# Altium schematic sheet medusa-ai-audio.SchDoc
size Legal; SheetNumber: 2; SheetTotal: 5
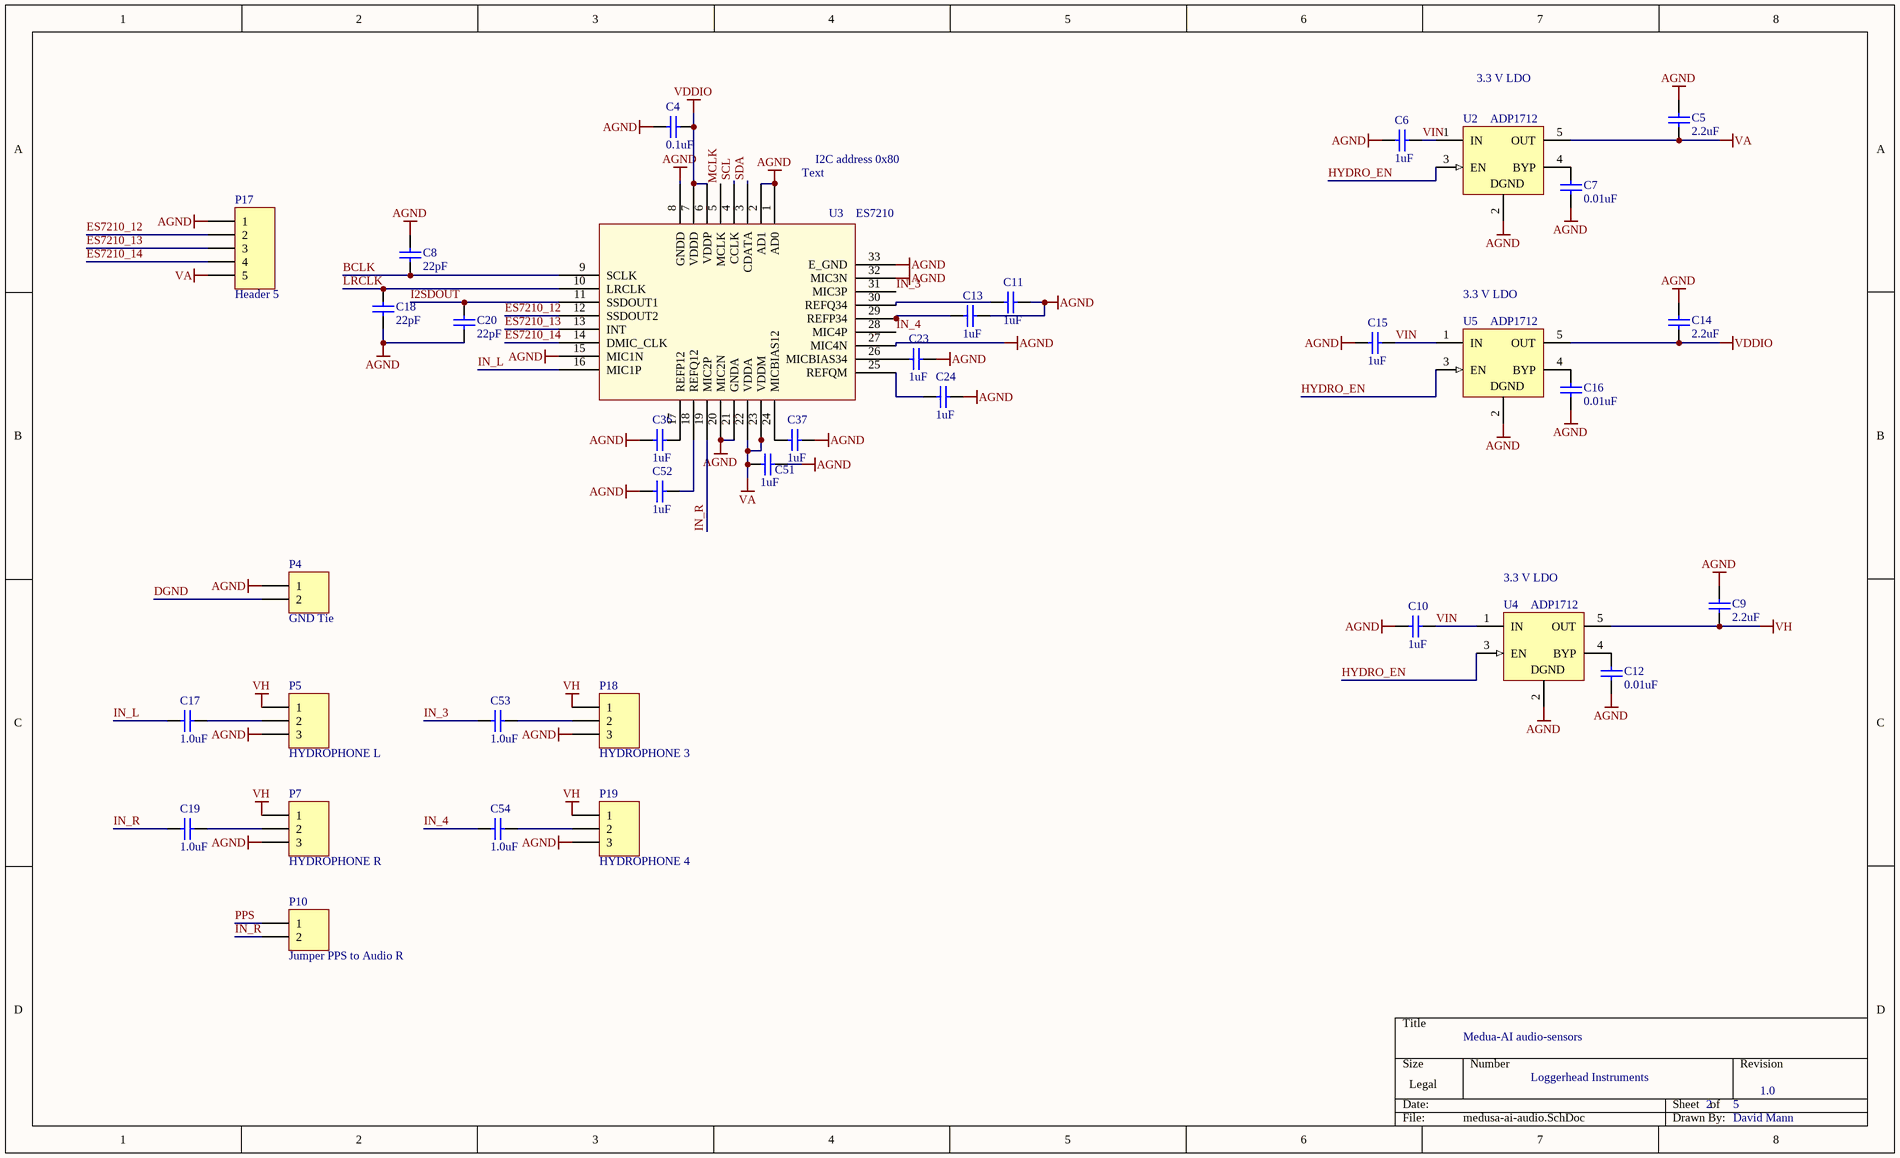
[diagram p0: medusa-ai-audio.SchDoc]

## Parts
C4  0.1uF  [0402]
C5  2.2uF  [0402]
C6  1uF  [0402]
C7  0.01uF  [0402]
C8  22pF  [0402]
C9  2.2uF  [0402]
C10  1uF  [0402]
C11  1uF  [0402]
C12  0.01uF  [0402]
C13  1uF  [0402]
C14  2.2uF  [0402]
C15  1uF  [0402]
C16  0.01uF  [0402]
C17  1.0uF  [0402]
C18  22pF  [0402]
C19  1.0uF  [0402]
C20  22pF  [0402]
C23  1uF  [0402]
C24  1uF  [0402]
C36  1uF  [0402]
C37  1uF  [0402]
C51  1uF  [0402]
C52  1uF  [0402]
C53  1.0uF  [0402]
C54  1.0uF  [0402]
P4  GND Tie  [HDR1X2]
P5  HYDROPHONE L  [HDR1X3]
P7  HYDROPHONE R  [HDR1X3]
P10  Jumper PPS to Audio R  [HDR1X2]
P17  Header 5  [HDR1X5]
P18  HYDROPHONE 3  [HDR1X3]
P19  HYDROPHONE 4  [HDR1X3]
U2  ADP1712  [MF05A_N]
U3  ES7210  [ES7210]
U4  ADP1712  [MF05A_N]
U5  ADP1712  [MF05A_N]

## Nets
AGND: C4.1 C5.2 C6.2 C7.2 C8.1 C9.2 C10.2 C11.1 C12.2 C13.1 C14.2 C15.2 C16.2 C18.2 C20.2 C23.1 C24.1 C36.2 C37.1 C51.1 C52.1 P4.1 P5.3 P7.3 P17.1 P18.3 P19.3 U2.2(GND) U3.1(AD0) U3.2(AD1) U3.8(GNDD) U3.15(MIC1N) U3.20(MIC2N) U3.21(GNDA) U3.27(MIC4N) U3.32(MIC3N) U3.33(E_GND) U4.2(GND) U5.2(GND)
VA: C5.1 C51.2 P17.5 U2.5(OUT) U3.22(VDDA) U3.23(VDDM)
VDDIO: C4.2 C14.1 U3.6(VDDP) U3.7(VDDD) U5.5(OUT)
VH: C9.1 P5.1 P7.1 P18.1 P19.1 U4.5(OUT)
BCLK: C8.2 U3.9(SCLK)
DGND: P4.2
ES7210_12: P17.2 U3.12(SSDOUT2)
ES7210_13: P17.3 U3.13(INT)
ES7210_14: P17.4 U3.14(DMIC_CLK)
HYDRO_EN: U2.3(EN) U4.3(EN) U5.3(EN)
I2SDOUT: C20.1 U3.11(SSDOUT1)
IN_3: C53.2 U3.31(MIC3P)
IN_4: C54.2 U3.28(MIC4P)
IN_L: C17.2 U3.16(MIC1P)
IN_R: C19.2 P10.2 U3.19(MIC2P)
LRCLK: C18.1 U3.10(LRCLK)
MCLK: U3.5(MCLK)
PPS: P10.1
SCL: U3.4(CCLK)
SDA: U3.3(CDATA)
VIN: C6.1 C10.1 C15.1 U2.1(IN) U4.1(IN) U5.1(IN)
NetC7_1: C7.1 U2.4(BYP)
NetC11_2: C11.2 U3.30(REFQ34)
NetC12_1: C12.1 U4.4(BYP)
NetC13_2: C13.2 U3.29(REFP34)
NetC16_1: C16.1 U5.4(BYP)
NetC17_1: C17.1 P5.2
NetC19_1: C19.1 P7.2
NetC23_2: C23.2 U3.26(MICBIAS34)
NetC24_2: C24.2 U3.25(REFQM)
NetC36_1: C36.1 U3.17(REFP12)
NetC37_2: C37.2 U3.24(MICBIAS12)
NetC52_2: C52.2 U3.18(REFQ12)
NetC53_1: C53.1 P18.2
NetC54_1: C54.1 P19.2

## Notes on the sheet
- 3.3 V LDO
- I2C address 0x80
- (near U3) Text
- (near U5) 3.3 V LDO
- (near U4) 3.3 V LDO
- Medua-AI audio-sensors
- Loggerhead Instruments
- 2
- 5
- 1.0
- David Mann
- (in symbol LP3985IM5-3.3) DGND

## Library data of the parts
C4 = C0402: Ceramic Chip Capacitor - Standard; Note: Footprint corresponds to dimensions for bulk cassette packaging. This case size has tightened tolerances.; Published: 17-Jul-2002; LatestRevisionDate: 19-Mar-2004; LatestRevisionNote: Silkscreen size reduced.; DatasheetDocument: Mar-2001; PackageDocument: Mar-2001; PackageReference: 0402; Publisher: Altium Limited; Code_JEITA: 0402; Code_IPC: 1005 [0402]; ComponentLink1Description: Manufacturer Link; ComponentLink1URL: http://www.kemet.com/; ComponentLink2Description: Datasheet; ComponentLink2URL: http://www.kemet.com/kemet/web/homepage/kechome.nsf/vapubfilesname/F3102TA.pdf/$file/F3102TA.pdf; Value: 0.1uF
C5-C20 C23 C24 C36 C37 C51-C54 = C0402: Ceramic Chip Capacitor - Standard; Note: Footprint corresponds to dimensions for bulk cassette packaging. This case size has tightened tolerances.; Value: 0.1uF; Published: 17-Jul-2002; LatestRevisionDate: 19-Mar-2004; LatestRevisionNote: Silkscreen size reduced.; DatasheetDocument: Mar-2001; PackageDocument: Mar-2001; PackageReference: 0402; Publisher: Altium Limited; Code_JEITA: 0402; Code_IPC: 1005 [0402]; ComponentLink1Description: Manufacturer Link; ComponentLink1URL: http://www.kemet.com/; ComponentLink2Description: Datasheet; ComponentLink2URL: http://www.kemet.com/kemet/web/homepage/kechome.nsf/vapubfilesname/F3102TA.pdf/$file/F3102TA.pdf
P4 P10 = Header 2: Header, 2-Pin; LatestRevisionDate: 17-Jul-2002; LatestRevisionNote: Re-released for DXP Platform.; Publisher: Altium Limited
P5 P7 P18 P19 = Header 3: Header, 3-Pin; LatestRevisionDate: 17-Jul-2002; LatestRevisionNote: Re-released for DXP Platform.; Publisher: Altium Limited
P17 = Header 5: Header, 5-Pin; LatestRevisionDate: 17-Jul-2002; LatestRevisionNote: Re-released for DXP Platform.; Publisher: Altium Limited
U2 U4 U5 = LP3985IM5-3.3: Micropower, 150mA Low-Noise Ultra Low-Dropout CMOS Voltage Regulator; Manufacturer: National Semiconductor; CompType: LDO IC; PackageTopMarking: LDQB*XTT; PowerWise: N; Published: 4-Dec-2008; DatasheetVersion: Aug-2005; PackageVersion: revD, Aug-2008; PackageReference: MF05A; Publisher: Altium Limited; PackageDescription: Molded SOT-23, .115 x .063 x .040 in Body, 5 Lead, .0375 in Pitch; PartNumber: LP3985IM5-3.3; RoHS: O; PinCount: 5; DigiKeyPartNumber: LP3985IM5-3.3CT-ND; ComponentLink1Description: LP3985 Datasheet; ComponentLink1URL: http://www.national.com/ds/LP/LP3985.pdf; ComponentLink2Description: LP3985 Web Page; ComponentLink2URL: http://www.national.com/pf/LP/LP3985.html; ComponentLink3Description: MF05A Package Page; ComponentLink3URL: http://www.national.com/packaging/folders/mf05a.html
U3 = ES7210: Audio CODEC